# EAGLE design main (EAGLE 7.5.0)
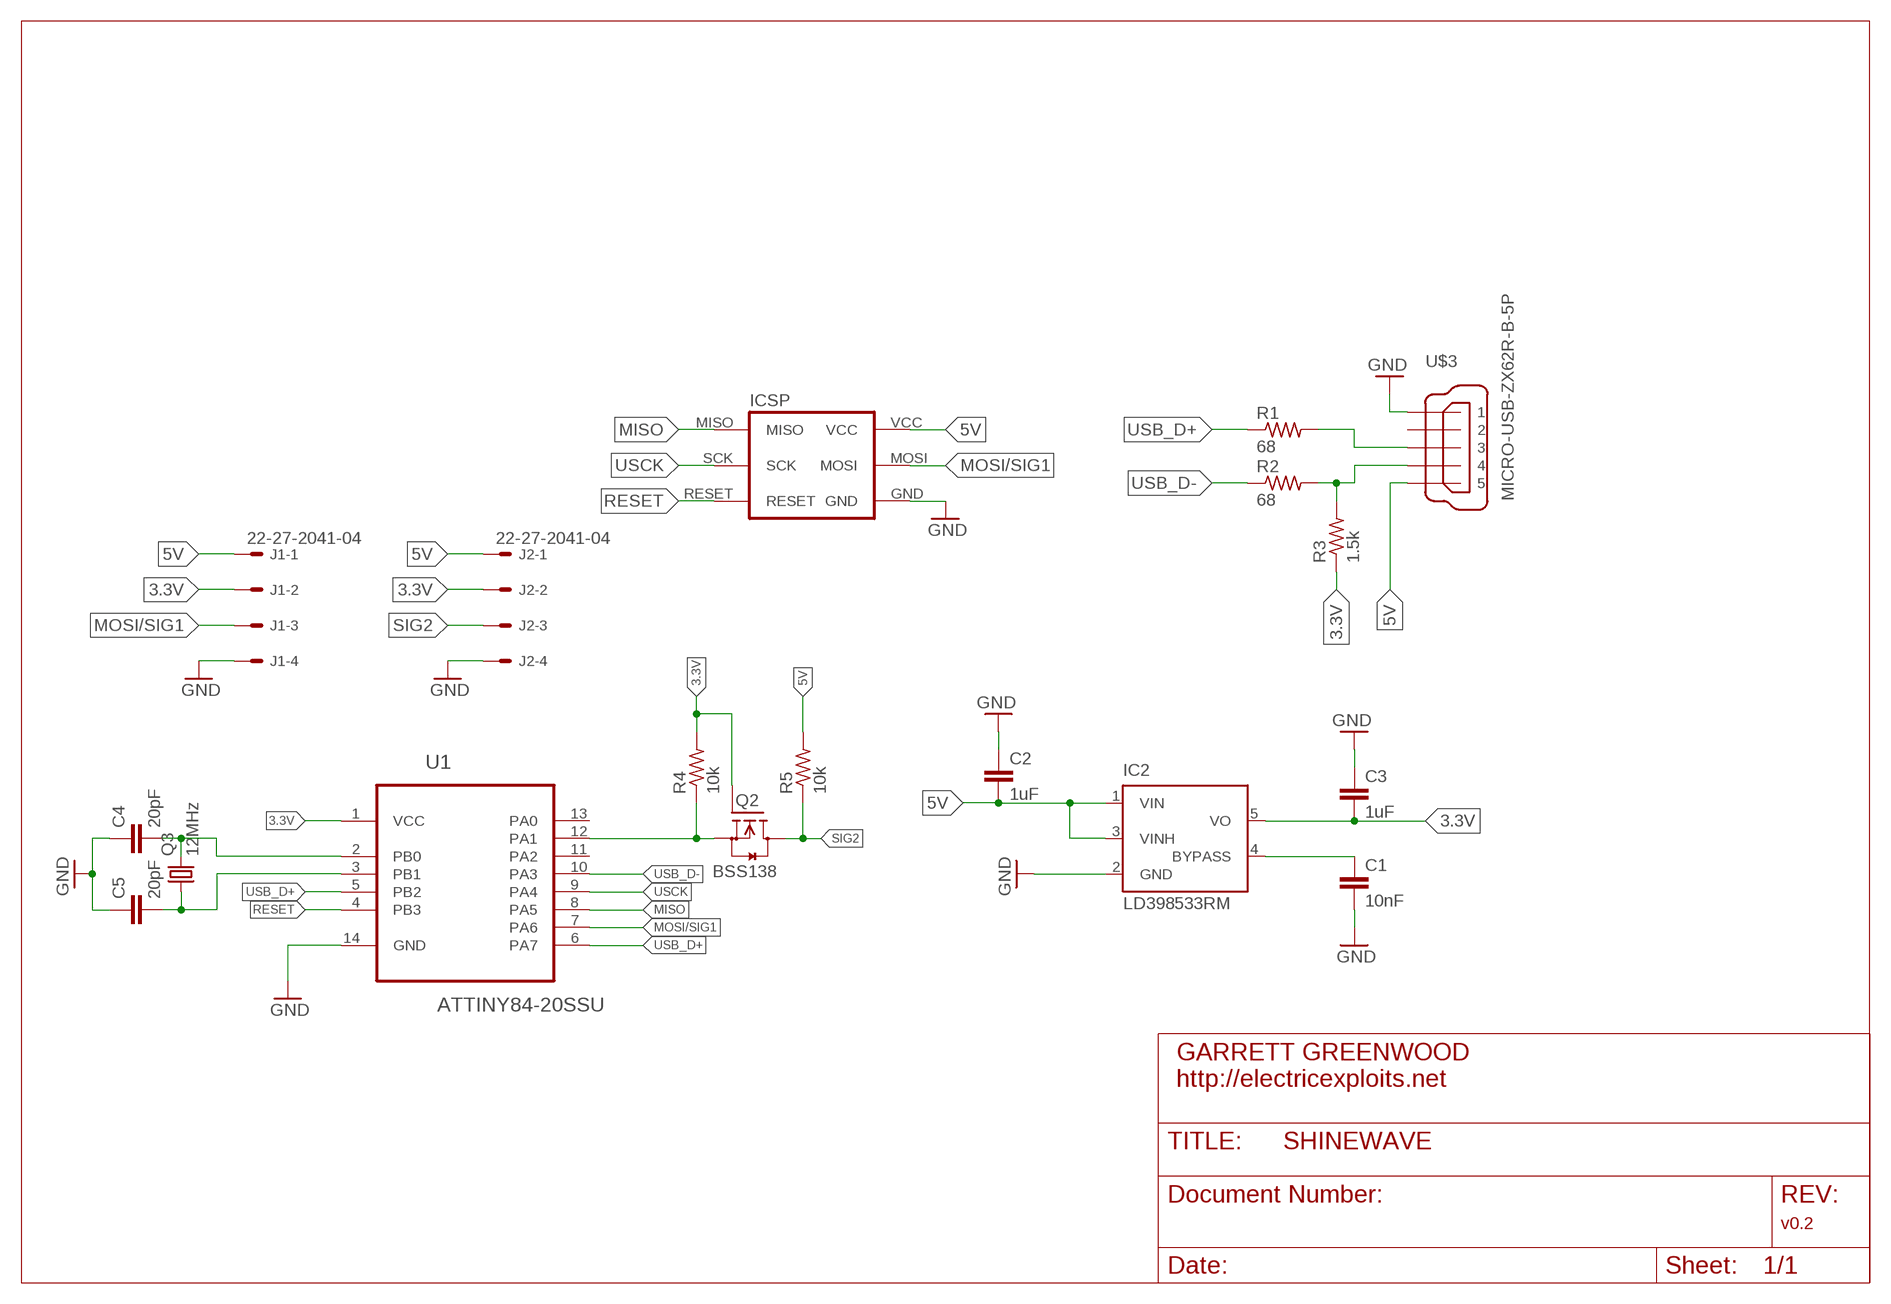
[diagram p0: schematic, sheet 1]

## Parts
C1  10nF  C-EUC0603  [C0603]
C2  1uF  C-EUC0603  [C0603]
C3  1uF  C-EUC0603  [C0603]
C4  20pF  C-EUC0603  [C0603]
C5  20pF  C-EUC0603  [C0603]
IC2  LD398533RM  [SOT23-5L]
J1  22-27-2041-04  [6410-04]
J2  22-27-2041-04  [6410-04]
Q2  BSS138  [SOT23]
Q3  12MHz  CRYSTALCTS406  [CTS406]
R1  68  R-US_R0603  [R0603]
R2  68  R-US_R0603  [R0603]
R3  1.5k  R-US_R0603  [R0603]
R4  10k  R-US_R0603  [R0603]
R5  10k  R-US_R0603  [R0603]
U1  ATTINY84-20SSU  [SOIC127P600X175-14N]
U$1  ICSP_POGO_INTERFACE  [ICSP_SMD]
U$3  MICRO-USB-ZX62R-B-5P  [ZX62R-B-5P]

## Nets
3.3V: C3.2 IC2.5(VO) J1.2 J2.2 Q2.1(G) R3.1 R4.2 U1.1(VCC)
5V: C2.2 IC2.1(VIN) IC2.3(VINH) J1.1 J2.1 R5.2 U$1.VCC U$3.5
GND: C1.2 C2.1 C3.1 C4.1 C5.1 IC2.2(GND) J1.4 J2.4 U1.14(GND) U$1.GND U$3.1
MISO: U1.8(PA5) U$1.MISO
MOSI/SIG1: J1.3 U1.7(PA6) U$1.MOSI
N$1: Q2.2(S) R4.1 U1.12(PA1)
N$4: C1.1 IC2.4(BYPASS)
N$5: R1.2 U$3.3
N$6: R2.2 R3.2 U$3.4
RESET: U1.4(PB3) U$1.RESET
SIG2: J2.3 Q2.3(D) R5.1
USB_D+: R1.1 U1.5(PB2) U1.6(PA7)
USB_D-: R2.1 U1.10(PA3)
USCK: U1.9(PA4) U$1.SCK
XTAL1: C4.2 Q3.3 U1.2(PB0)
XTAL2: C5.2 Q3.1 U1.3(PB1)
Unconnected: U1.11(PA2) U1.13(PA0) U$3.2

## Library data of the parts
C1-C5 = resistor:C-EU: CAPACITOR, European symbol
IC2 = st-microelectronics:LD3985: Ultra low drop and low noise BiCMOS voltage regulators Source: www.st.com LD3985.pdf
J1 J2 = con-molex:22-?-04: CONNECTOR wire to board 2.54 mm (.1 inch) pitch header; OC_FARNELL: unknown; OC_NEWARK: unknown
Q2 = m-pad-2.1:BSS138: Fairchild Semiconductors BSS138 N-Channel Logic Level Enhancement Mode Field Effect Transistor General Description: These N-Channel enhancement mode field effect transistors are produced using Fairchild's proprietary, high cell density, DMOS technology. These products have been designed to minimize on-state resistance while provide rugged, reliable, and fast switching performance.These products are particularly suited for low voltage, low current applications such as small servo motor control, power MOSFET gate drivers, and other switching applications. Features: 0.22 A, 50 V. RDS(ON) = 3.5Ohm @ VGS = 10 V RDS(ON) = 6.0Ohm @ VGS = 4.5 V High density cell design for extremely low RDS(ON) Rugged and Reliable Compact industry standard SOT-23 surface mount package Please send any comments to: messi@users.sourceforge.net
Q3 = crystal:CRYSTAL: CRYSTAL; OC_FARNELL: unknown; OC_NEWARK: unknown
R1-R5 = resistor:R-US_: RESISTOR, American symbol
U1 = Atmel_By_element14_Batch_1-00:ATTINY84-20SSU: 8-bit Microcontroller with Bytes In-System Programmable Flash; MPN: ATTINY84-20SSU; OC_FARNELL: 1636955; OC_NEWARK: 03P2040; PACKAGE: SOIC-14; SUPPLIER: Atmel
U$1 = shinewave:ICSP_POGO_INTERFACE: ICSP pads for programming over a pogo-pin interface.
U$3 = con-hirose:MICRO-USB-: Hirose Micro USB Connector ZX62R-B-5P: Micro B, reverse (top mount) shell SMT Supplier: DigiKey H11574CT-ND Source: http://www.hirose.co.jp/cataloge_hp/e24200011.pdf

## Board
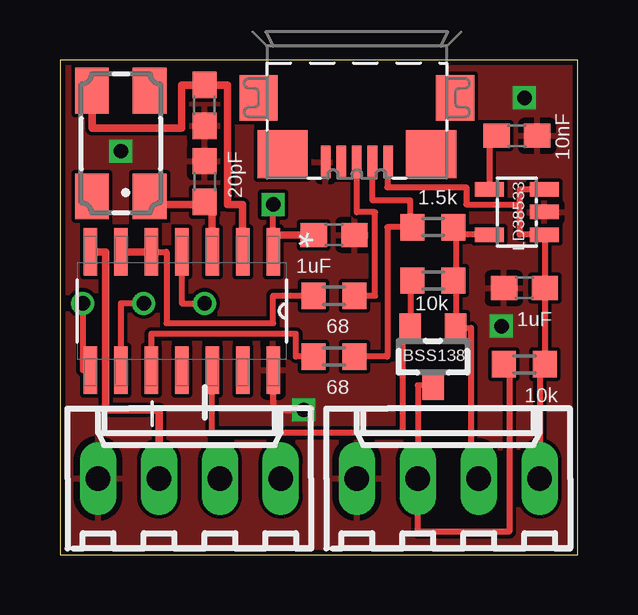
[diagram p1: board, top side]
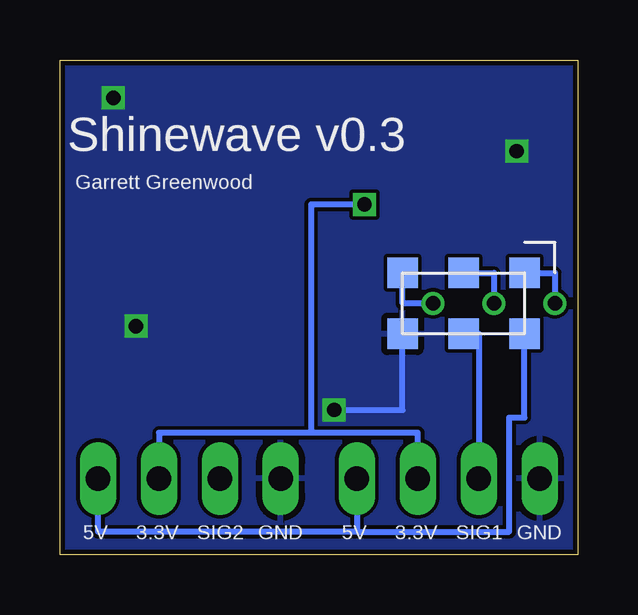
[diagram p2: board, bottom side, seen from below]

Size 21.59 x 20.63 mm. Coordinates in mm from the lower left corner, seen from the top.
Outline: 0,0 21.59,0 21.59,20.63 0,20.63 0,0
Copper layers (1*16): Top 0.0356mm / dielectric 1.5011mm / Bottom 0.0356mm
Design rules "LaenPCBOrder *": minimum track width 6mil, minimum drill 13mil, track to track 6mil, track to pad 6mil, pad to pad 6mil, via to via 6mil, smd to smd 6mil, copper to edge 8mil, drill to drill 6mil, minimum pad ring 7mil, minimum via ring 7mil, stop-mask expansion 3mil, vias tented up to drill 0mil, thermal gap 10mil

### Footprints (pad centres in the part's own frame; a part is rotated, then mirrored left to right if it is on the bottom)
C0603 = smd 1.1 x 1: 1 -0.85,0; 2 0.85,0
SOT23-5L = smd 0.6 x 1.2: 1 -0.95,-1.15; 2 0,-1.15; 3 0.95,-1.15; 4 0.95,1.15; 5 -0.95,1.15
6410-04 = drill 1.016 long: 1 3.81,0; 2 1.27,0; 3 -1.27,0; 4 -3.81,0
SOT23 = smd 0.9 x 1.2: 1 -0.95,-1.2; 2 0.95,-1.2; 3 0,1.2
CTS406 = smd 1.9 x 1.4: 1 -2.2,-1.2; 2 2.2,-1.2; 3 2.2,1.2; 4 -2.2,1.2
R0603 = smd 1 x 1.1: 1 -0.85,0; 2 0.85,0
SOIC127P600X175-14N = smd 1.981 x 0.559: 1 -2.464,3.81; 2 -2.464,2.54; 3 -2.464,1.27; 4 -2.464,0; 5 -2.464,-1.27; 6 -2.464,-2.54; 7 -2.464,-3.81; 8 2.464,-3.81; 9 2.464,-2.54; 10 2.464,-1.27; 11 2.464,0; 12 2.464,1.27; 13 2.464,2.54; 14 2.464,3.81
ICSP_SMD = smd 1.27 x 1.27 bottom: GND 0,0; MISO 2.54,5.08; MOSI 0,2.54; RESET 2.54,0; SCK 2.54,2.54; VCC 0,5.08
ZX62R-B-5P = smd 1.35 x 0.4: 1 2.675,-1.3; 2 2.675,-0.65; 3 2.675,0; 4 2.675,0.65; 5 2.675,1.3 | smd 1.9 x 1.6: M1 0,-4.1; M2 0,4.1 | smd 2 x 2.1: M3 2.35,3.1; M4 2.35,-3.1

### Placement (x,y rotation side)
C1  19.05,17.46 0 top
C2  19.37,11.11 0 top
C3  11.43,13.34 180 top
C4  6.03,18.73 90 top
C5  6.03,15.56 270 top
IC2  19.05,14.29 90 top
J1  5.4,3.18 0 top
J2  16.19,3.18 0 top
Q2  15.56,8.26 180 top
Q3  2.54,17.14 90 top
R1  11.43,10.79 0 top
R2  11.43,8.26 0 top
R3  15.56,13.65 180 top
R4  15.56,11.43 0 top
R5  19.37,7.94 0 top
U1  5.08,10.16 270 top
U$1  7.3,9.21 90 top
U$3  12.38,19.05 270 top

### Tracks (layer width: path | path; a pad name or v marks a point on that pad's centre or on a via)
3.3V  (via drill 0.6)
  Top 0.254: 16.51,11.43 16.51,13.65 R3.1 16.09,13.34 IC2.5 | 16.51,11.43 Q2.1 17.15,9.46 17.15,3.81 17.46,3.81 J2.2 | 8.89,13.34 v8.89,14.61 | R4.2 16.51,11.43
  Top 0.305: C3.2 8.89,13.34 U1.1
  Bottom 0.254: J1.2 6.67,5.08 11.11,5.08 | 11.11,5.08 17.46,5.08 J2.2 | v8.89,14.61 11.11,14.61 11.11,5.08
5V
  Top 0.254: U$3.5 13.65,16.38 13.65,15.32 16.95,15.32 16.95,14.61 19.17,14.61 | 19.17,14.61 19.17,15.24 IC2.3 | 19.17,14.61 19.17,13.34 IC2.1 20.22,13.34 C2.2 R5.2 20,7.94 J2.1
  Bottom 0.254: 9.21,0.95 2.86,0.95 2.86,5.71 2.22,5.71 U$1.VCC | J1.1 9.21,0.95 | 9.21,0.95 20,0.95 J2.1
GND  (via drill 0.6)
  Top 0.254: U1.14 8.89,6.03 v10.16,6.03
  Bottom 0.254: v10.16,6.03 7.3,6.03 U$1.GND
  other vias: 2.54,16.83 19.37,19.05 18.42,9.53
  pour Bottom: 0,20.64 21.59,20.64 21.59,0 0,0
  pour Top: 0,20.64 21.59,20.64 21.59,0 0,0
MISO  (via drill 0.6)
  Top 0.254: v0.95,10.48 0.95,7.7 U1.8
  Bottom 0.254: U$1.MISO 0.95,11.75 v0.95,10.48
MOSI/SIG1
  Top 0.305: U1.7 1.91,12.62 1.91,6.03 4.13,6.03 J1.3
  Bottom 0.254: U$1.MOSI 4.13,9.21 J1.3
N$1
  Top 0.254: R4.1 14.61,11.43 Q2.2 14.29,9.46 14.29,5.08 6.35,5.08 U1.12
N$4
  Top 0.254: C1.1 17.9,17.46 IC2.4
N$5
  Top 0.254: R1.2 13.14,10.79 13.14,14.28 12.38,14.28 U$3.3
N$6
  Top 0.254: R3.2 14.6,13.65 | 14.6,13.65 14.6,14.76 13.03,14.76 U$3.4 | 14.6,13.65 13.65,13.65 13.65,8.26 R2.2
RESET  (via drill 0.6 pad 0.25)
  Top 0.254: U1.4 5.08,10.48 v6.03,10.48
  Bottom 0.254: v6.03,10.48 7.3,10.48 U$1.RESET
SIG2
  Top 0.254: R5.1 18.73,7.94 18.73,0.95 14.92,0.95 J2.3 14.92,7.05 Q2.3
USB_D+
  Top 0.254: R1.1 8.89,10.79 8.89,9.65 4.44,9.65 4.44,12.62 U1.5
  Top 0.305: U1.6 U1.5
USB_D-
  Top 0.254: R2.1 9.84,8.26 9.84,9.21 3.81,9.21 U1.10
USCK  (via drill 0.6 pad 0.25)
  Top 0.254: v3.49,10.48 2.54,10.48 U1.9
  Bottom 0.254: U$1.SCK 3.49,11.75 v3.49,10.48
XTAL1
  Top 0.305: Q3.3 1.34,17.78 5.08,17.78 5.08,19.58 C4.2 6.98,19.58 6.98,14.61 7.62,14.61 U1.2
XTAL2
  Top 0.305: Q3.1 4.13,14.95 4.13,14.61 6.03,14.61 C5.2 6.35,14.71 U1.3

### Text on the board
bPlace: Shinewave v0.3 | Garrett Greenwood | GND | SIG1 | 3.3V | 5V | GND | SIG2 | 3.3V | 5V
tNames: LD38533 | BSS138